# Altium schematic sheet Attiny.SchDoc
size A4
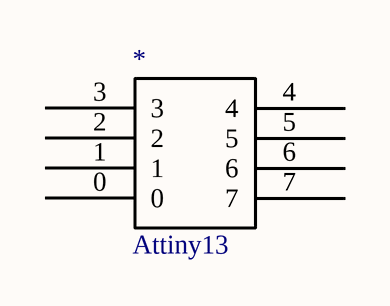
[diagram p0: Attiny.SchDoc]

## Parts
*  Attiny13  [ATTINY13]

## Nets

Not connected (* = marked no-connect by the designer): * 0 1 2 3 4 5 6 7